# Altium schematic sheet RS485_SN75176B.SchDoc
size A4
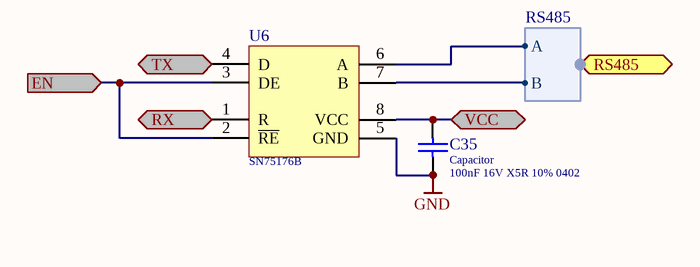
[diagram p0: RS485_SN75176B.SchDoc]

## Parts
C35  Capacitor  value 100nF 16V X5R 10% 0402  [0402]
U6  SN75176B  [SOIC-8]

## Ports
EN (in), RS485 (harness RS485), RX (out), TX (in), VCC

## Harnesses
RS485: A, B

## Nets
GND: C35.1 U6.5(GND)
EN: U6.2(~{RE}) U6.3(DE) ; port EN
RX: U6.1(R) ; port RX
TX: U6.4(D) ; port TX
VCC: C35.2 U6.8(VCC) ; port VCC
NetU6_6: U6.6(A) ; port RS485.A
NetU6_7: U6.7(B) ; port RS485.B

## Library data of the parts
C35 = Capacitor ceramic: Ceramic capacitor; Voltage: 16V; Tolerance: 10%; Capacitance: 100nF; Dielectric: X5R
U6 = SN75176B: 3.3 V, 15 kV ESD, 12 Mbps RS-485/RS-422 transceiver; Supplier: http://www.compel.ru/infosheet/TI/SN75176BDR/; Datasheet: http://www.ti.com.cn/cn/lit/ds/symlink/sn65176b.pdf; Price(1): 0.3407; Price(100): 0.2840